# EAGLE design LED_PCB (EAGLE 6.5.0)
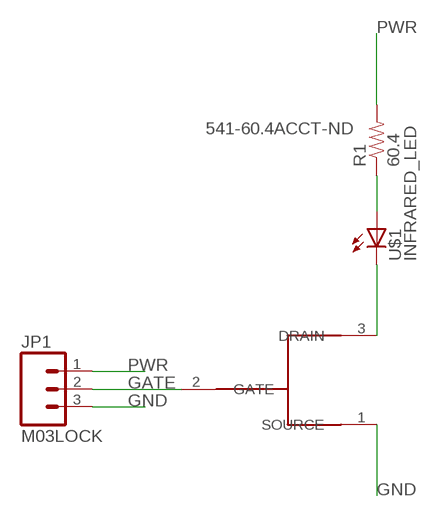
[diagram p0: schematic, sheet 1]

## Parts
JP1  M03LOCK  [1X03_LOCK]
R1  60.4  RESISTOR2010  [R2010]
U$1  INFRARED_LED  [MINI_MIDLED]
U$2  N-CH_MOSFET  [SOT-416]

## Nets
GATE: JP1.2 U$2.2(GATE)
GND: JP1.3 U$2.1(SOURCE)
N$1: R1.1 U$1.1(A)
N$2: U$1.2(C) U$2.3(DRAIN)
PWR: JP1.1 R1.2

## Library data of the parts
JP1 = ASL:M03: Header 3 Standard 3-pin 0.1" header. Use with straight break away headers (SKU : PRT-00116), right angle break away headers (PRT-00553), swiss pins (PRT-00743), machine pins (PRT-00117), and female headers (PRT-00115). Molex polarized connector foot print use with SKU : PRT-08232 with associated crimp pins and housings.
R1 = ASL:RESISTOR: Resistor Basic schematic elements and footprints for 0603, 1206, and PTH resistors.; DIGIKEY_PART: 541-60.4ACCT-ND
U$1 = led_board_lib:INFRARED_LED
U$2 = led_board_lib:N-CH_MOSFET; DIGIKEY_PART: 2SK3019TLCT-ND; PART_NUMBER: 2SK3019TL

## Board
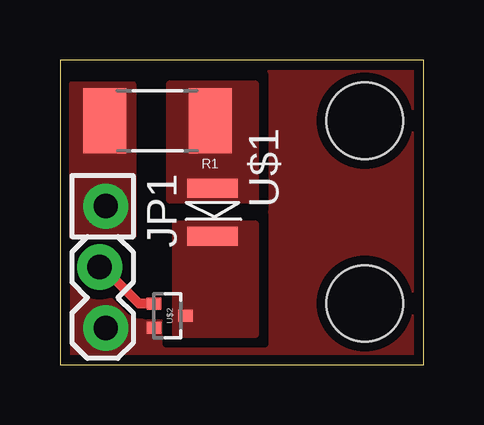
[diagram p1: board, top side]
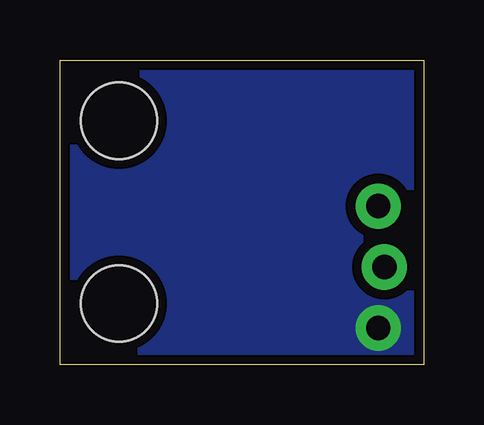
[diagram p2: board, bottom side, seen from below]

Size 15.16 x 12.69 mm. Coordinates in mm from the lower left corner, seen from the top.
Outline: 0,0 15.16,0 15.16,12.69 0,12.69 0,0
Copper layers (1*16): Top 0.035mm / dielectric 1.5mm / Bottom 0.035mm
Design rules "ITEADstudio_DRC": minimum track width 6mil, minimum drill 12mil, track to track 6mil, track to pad 6mil, pad to pad 6mil, via to via 6mil, smd to smd 0mil, copper to edge 10mil, drill to drill 10mil, minimum pad ring 10mil, minimum via ring 6mil, stop-mask expansion 2mil, vias tented up to drill 100mil, thermal gap 10mil
Holes 3.17 mm at 12.7,2.54 12.7,10.16

### Footprints (pad centres in the part's own frame; a part is rotated, then mirrored left to right if it is on the bottom)
1X03_LOCK = drill 1.016 pad 1.88: 1 0,0.127; 2 2.54,-0.127; 3 5.08,0.127
R2010 = smd 1.8 x 2.7: 1 -2.2,0; 2 2.2,0
MINI_MIDLED = smd 0.8 x 2.1: 1 -1,0; 2 1,0
SOT-416 = smd 0.5 x 0.6: 1 0.5,-0.65; 2 -0.5,-0.65; 3 0,0.65

### Placement (x,y rotation side)
JP1  1.78,6.6 270 top
R1  4.06,10.16 180 top
U$1  6.35,6.35 270 top
U$2  4.57,2.03 270 top

### Tracks (layer width: path | path; a pad name or v marks a point on that pad's centre or on a via)
GATE
  Top 0.406: U$2.2 3.3,2.54 1.78,4.06 JP1.2
GND
  pour Top (isolate 0.406, rank 2, no thermals): 0.25,0.25 0.25,12.45 14.99,12.45 14.99,0.25
  pour Bottom (isolate 0.406, no thermals): 0,12.45 0,0 14.99,0 14.99,12.45
N$1
  pour Top (no thermals): 4.57,11.68 4.57,6.86 8.13,6.86 8.13,11.68
N$2
  pour Top (no thermals): 4.83,5.84 4.83,1.27 8.13,1.27 8.13,5.84
PWR
  pour Top (no thermals): 0.51,5.33 0.51,11.68 3.05,11.68 3.05,5.33